# EAGLE design Reciever (EAGLE 8.4.0)
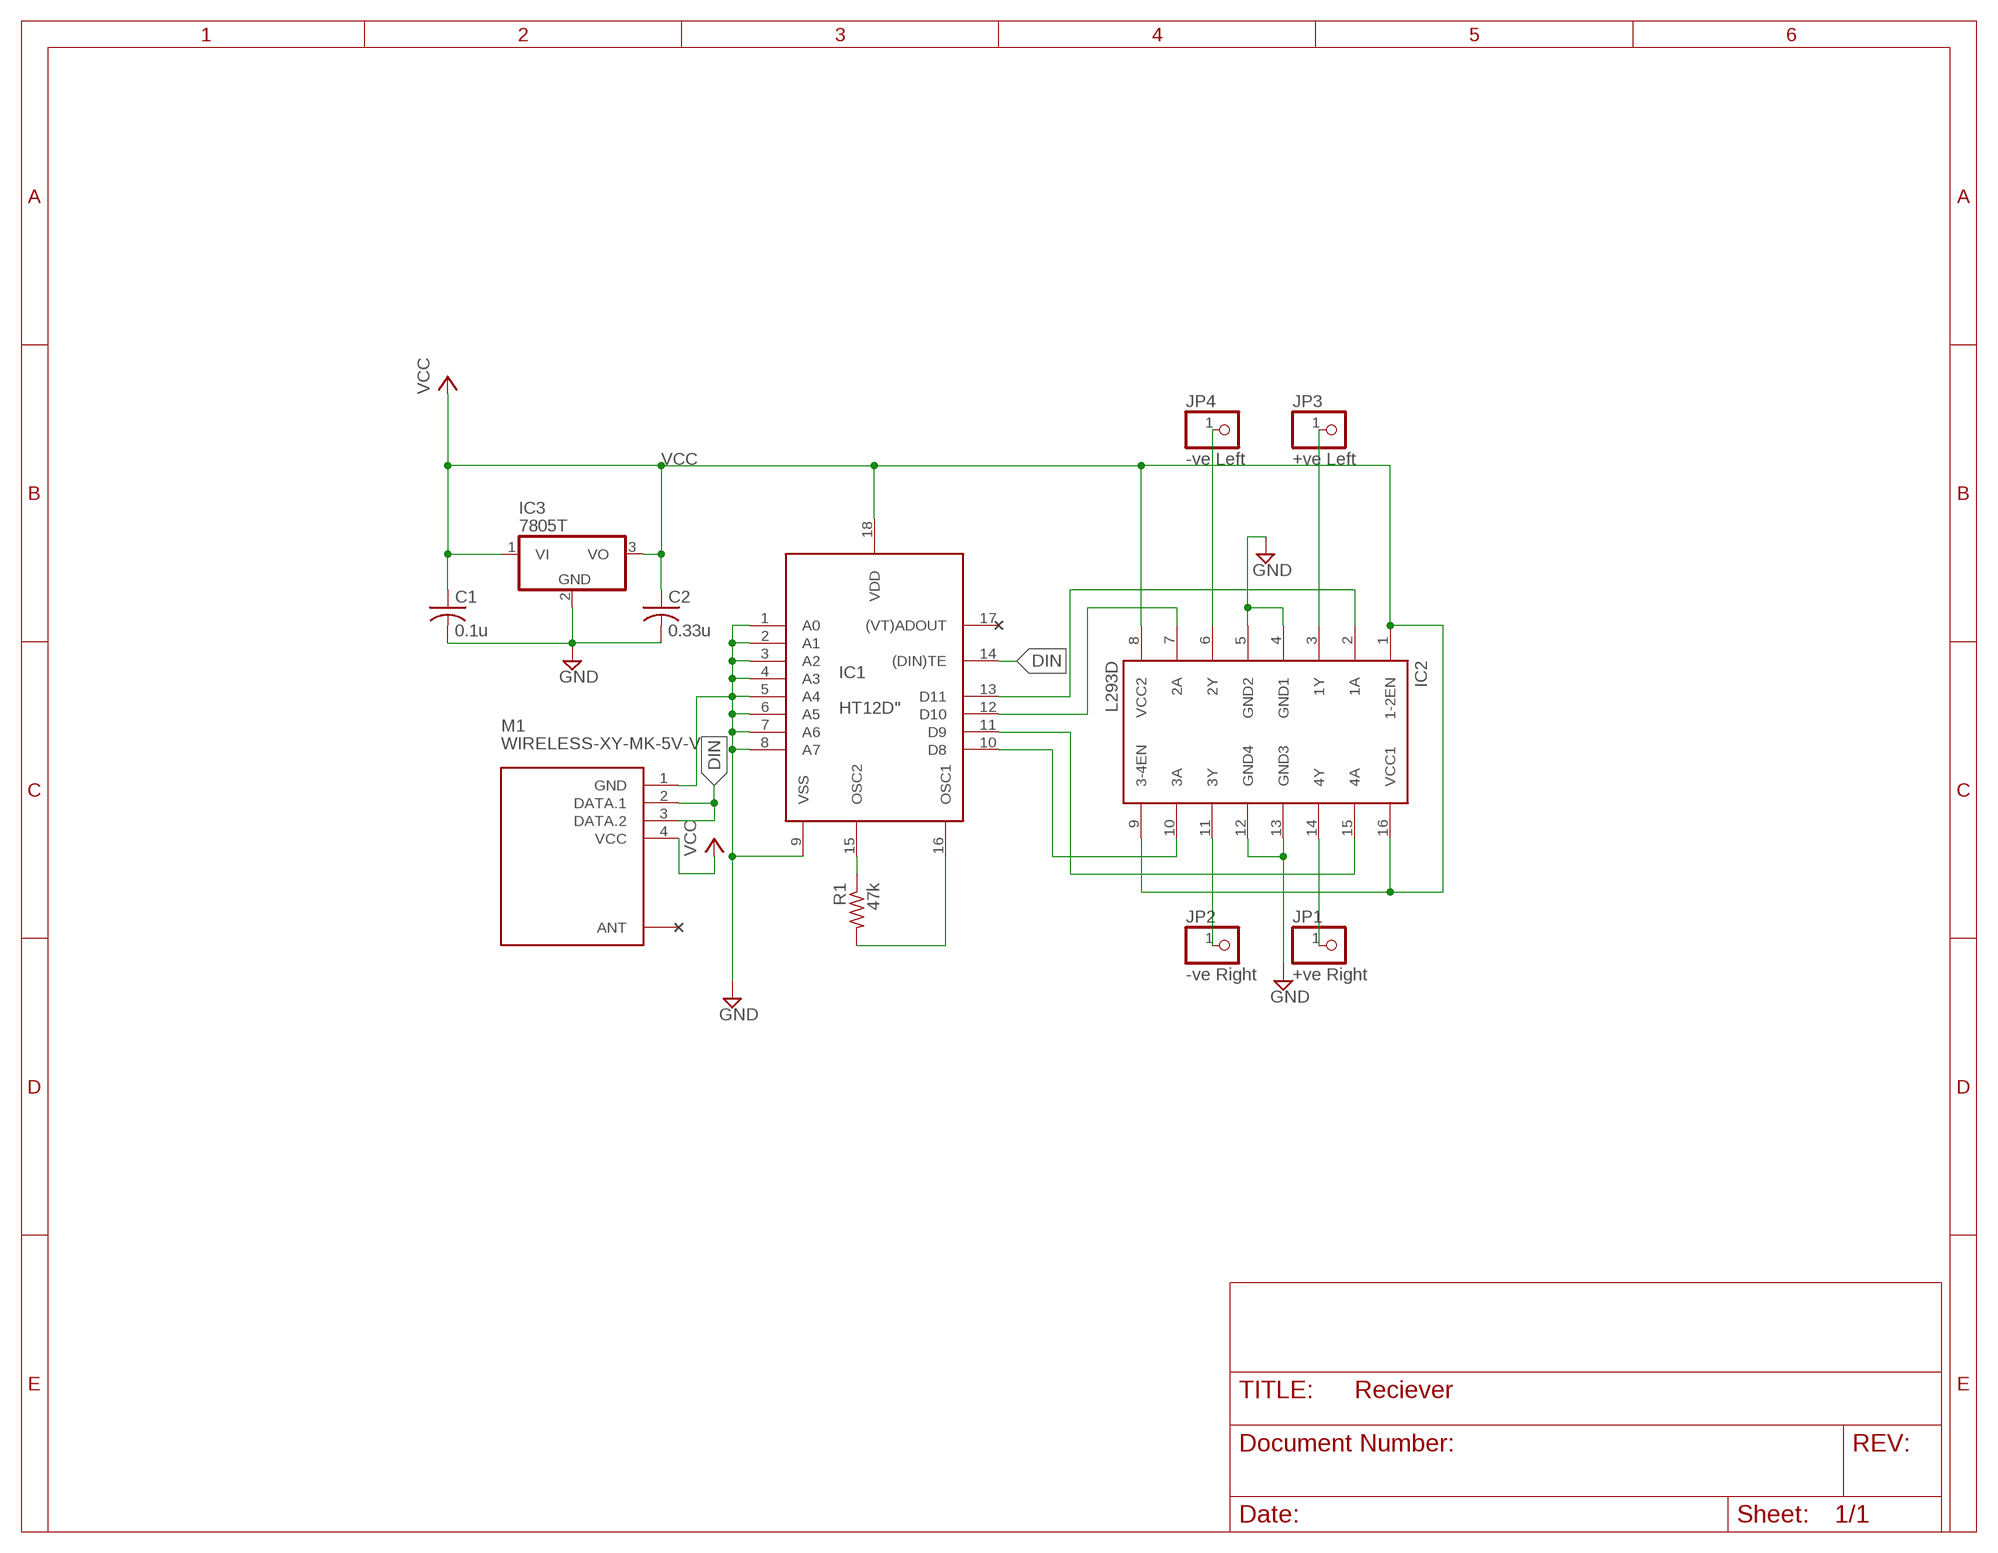
[diagram p0: schematic, sheet 1]

## Parts
C1  0.1u  C-USC0805  [C0805]
C2  0.33u  C-USC0805  [C0805]
IC1  HT12D"  [18-DIP-A]
IC2  L293D  [DIL16]
IC3  7805T  [TO220H]
JP1  +ve Right  PINHD-1X1  [1X01]
JP2  -ve Right  PINHD-1X1  [1X01]
JP3  +ve Left  PINHD-1X1  [1X01]
JP4  -ve Left  PINHD-1X1  [1X01]
M1  WIRELESS-XY-MK-5V-V  [WIRELESS-XY-MK-5V#V]
R1  47k  R-US_R0805  [R0805]

## Nets
DIN: IC1.14((DIN)TE) M1.2(DATA.1) M1.3(DATA.2)
GND: C1.2 C2.2 IC1.1(A0) IC1.2(A1) IC1.3(A2) IC1.4(A3) IC1.5(A4) IC1.6(A5) IC1.7(A6) IC1.8(A7) IC1.9(VSS) IC2.4(GND1) IC2.5(GND2) IC2.12(GND4) IC2.13(GND3) IC3.2(GND) M1.1(GND)
N$2: IC2.6(2Y) JP4.1
N$3: IC1.10(D8) IC2.10(3A)
N$4: IC1.15(OSC2) R1.1
N$5: IC1.16(OSC1) R1.2
N$6: IC1.11(D9) IC2.15(4A)
N$7: IC1.12(D10) IC2.7(2A)
N$8: IC1.13(D11) IC2.2(1A)
N$9: IC2.3(1Y) JP3.1
N$11: IC2.11(3Y) JP2.1
N$12: IC2.14(4Y) JP1.1
VCC: C1.1 C2.1 IC1.18(VDD) IC2.1(1-2EN) IC2.8(VCC2) IC2.9(3-4EN) IC2.16(VCC1) IC3.1(VI) IC3.3(VO) M1.4(VCC)
Unconnected: IC1.17((VT)ADOUT) M1.ANT

## Library data of the parts
C1 C2 = adafruit:C-US: CAPACITOR, American symbol
IC1 = holtek:HT12D: decoder = receiver ic
IC2 = st-microelectronics:L293D: PUSH-PULL 4 CHANNEL DRIVER; MPN: L293D; OC_FARNELL: 9589619; OC_NEWARK: 56P8249
IC3 = adafruit:78*: Positive VOLTAGE REGULATOR Added bigger pads to the TO-92 package
JP1-JP4 = adafruit:PINHD-1X1: Pin header 1x1 for 0.1" spacing With round pins
M1 = diy-modules:WIRELESS-XY-MK-5V: RF Wireless XY-MK-5V Receiver Click here to find device on ebay.com <http://www.ebay.com/sch/xd+rf+5v-receiver> Note: Sold together with transmitter.
R1 = adafruit:R-US_: RESISTOR, American symbol

## Board
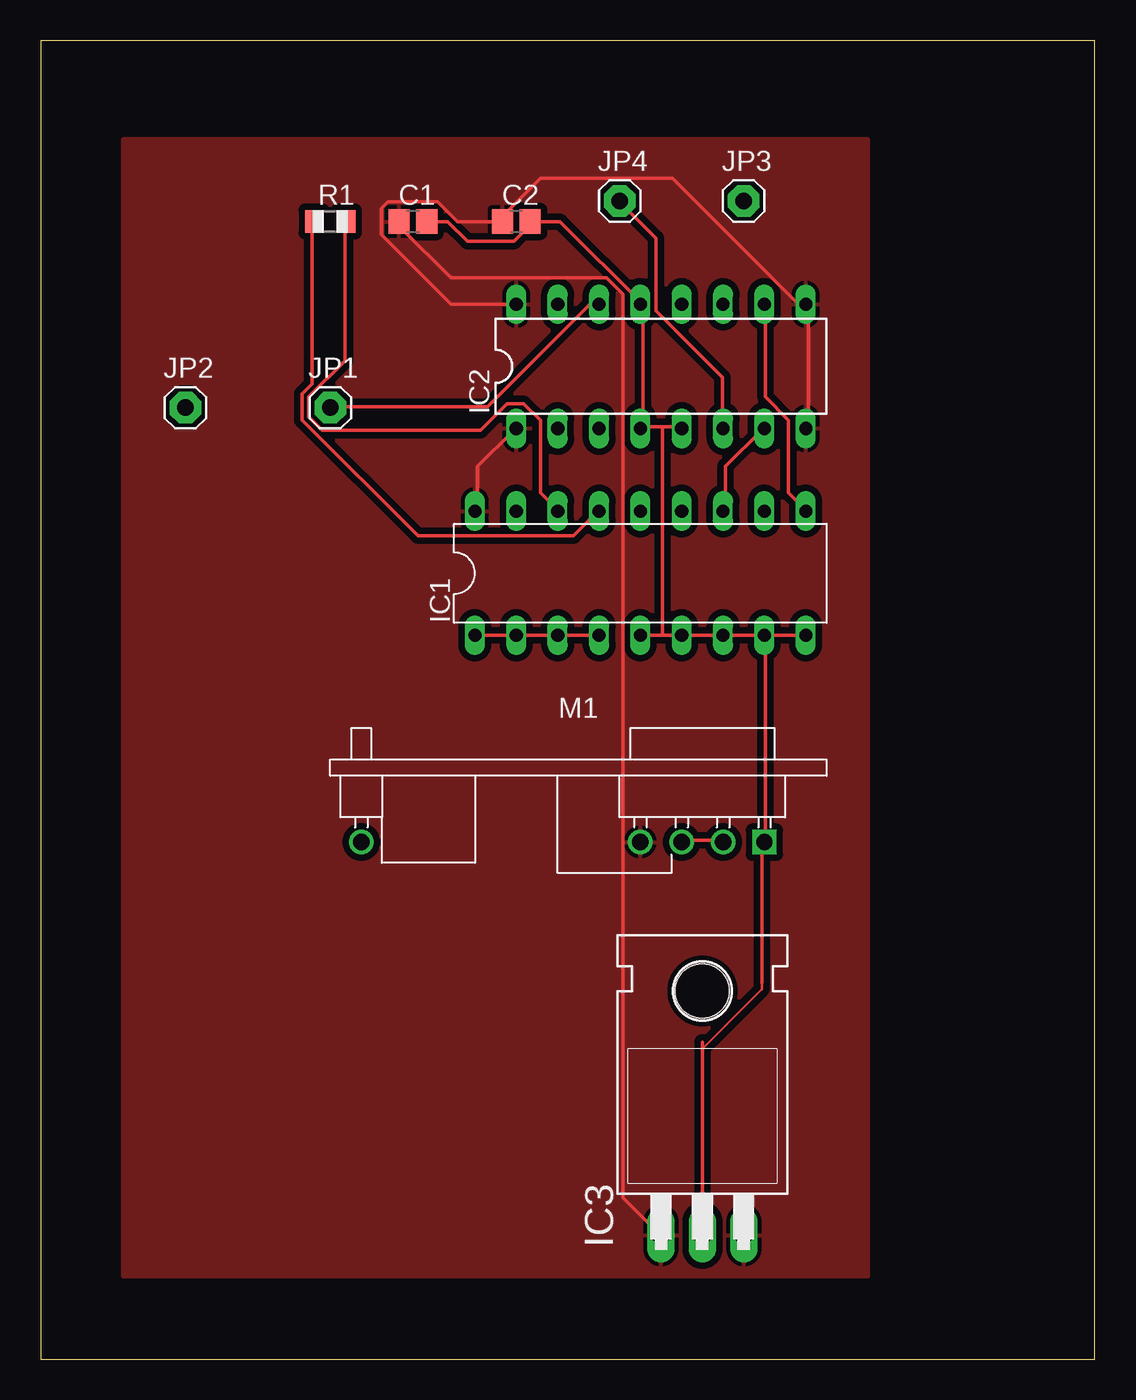
[diagram p1: board, top side]
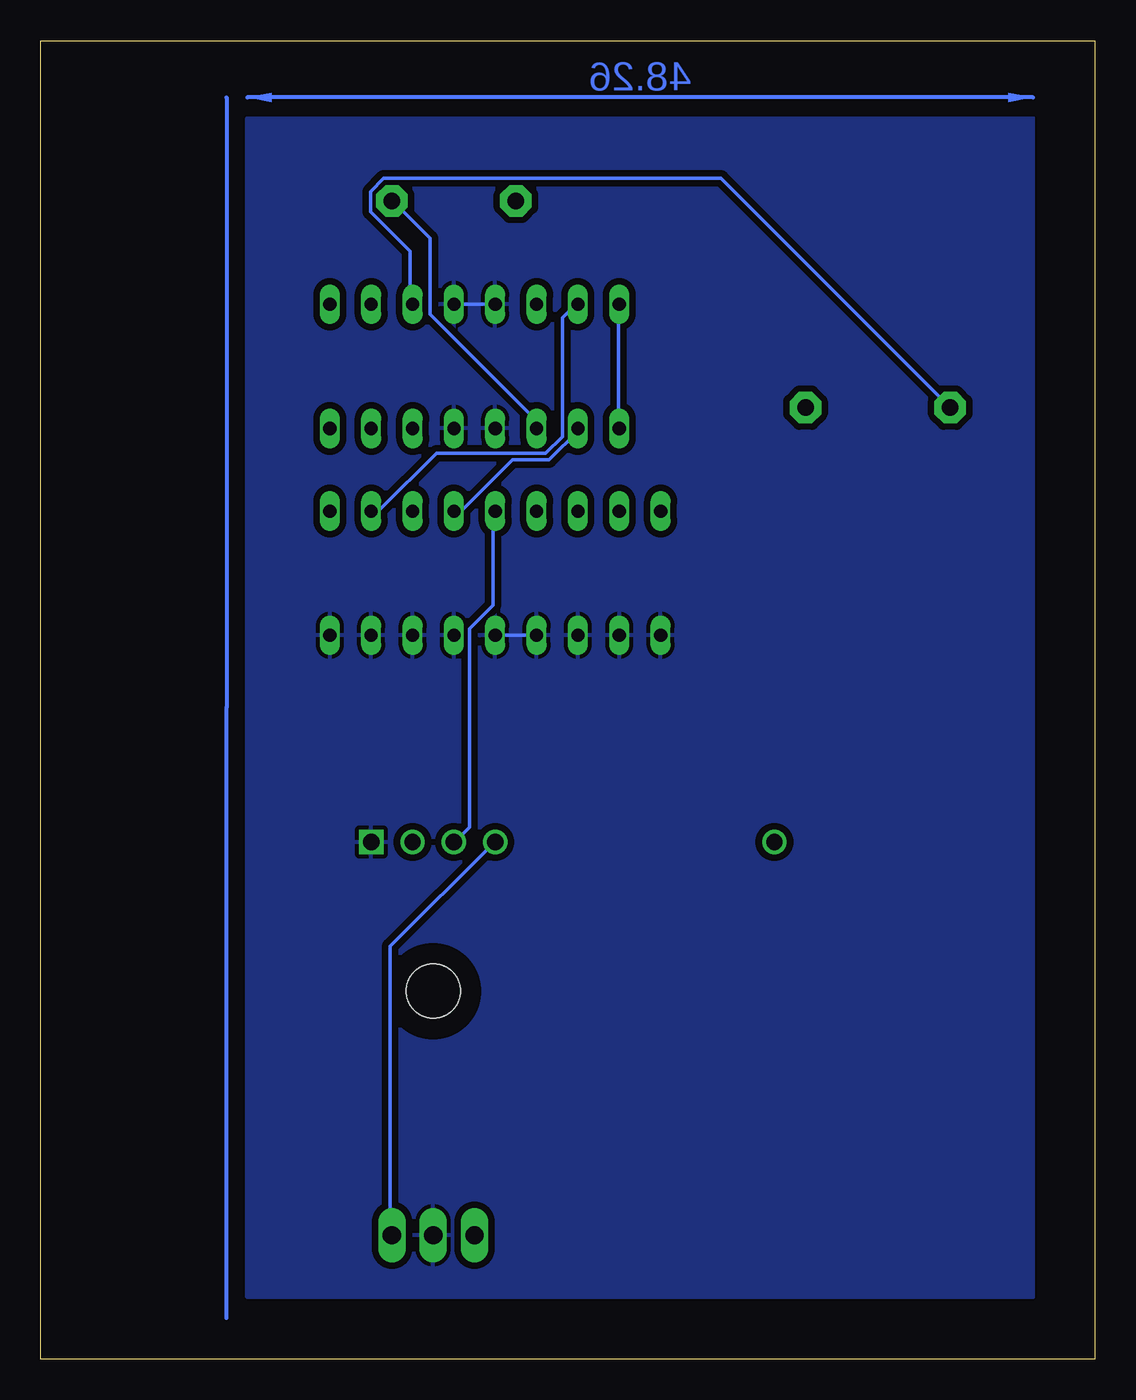
[diagram p2: board, bottom side, seen from below]

Size 64.75 x 80.95 mm. Coordinates in mm from the lower left corner, seen from the top.
Outline: 0,0 64.75,0 64.75,80.95 0,80.95 0,0
Copper layers (1*16): Top 0.0178mm / dielectric 59mil / Bottom 0.0178mm
Design rules "sunstone-valueproto *": minimum track width 6mil, minimum drill 6mil, track to track 7mil, track to pad 7mil, pad to pad 7mil, via to via 7mil, smd to smd 7mil, copper to edge 20mil, drill to drill 16mil, minimum pad ring 8mil, minimum via ring 8mil, stop-mask expansion 3mil, vias tented up to drill 0mil, thermal gap 10mil

### Footprints (pad centres in the part's own frame; a part is rotated, then mirrored left to right if it is on the bottom)
C0805 = smd 1.3 x 1.5: 1 -0.85,0; 2 0.85,0
18-DIP-A = drill 0.813 long: 1 -10.16,-3.81; 2 -7.62,-3.81; 3 -5.08,-3.81; 4 -2.54,-3.81; 5 0,-3.81; 6 2.54,-3.81; 7 5.08,-3.81; 8 7.62,-3.81; 9 10.16,-3.81; 10 10.16,3.81; 11 7.62,3.81; 12 5.08,3.81; 13 2.54,3.81; 14 0,3.81; 15 -2.54,3.81; 16 -5.08,3.81; 17 -7.62,3.81; 18 -10.16,3.81
DIL16 = drill 0.813 long: 1 -8.89,-3.81; 2 -6.35,-3.81; 3 -3.81,-3.81; 4 -1.27,-3.81; 5 1.27,-3.81; 6 3.81,-3.81; 7 6.35,-3.81; 8 8.89,-3.81; 9 8.89,3.81; 10 6.35,3.81; 11 3.81,3.81; 12 1.27,3.81; 13 -1.27,3.81; 14 -3.81,3.81; 15 -6.35,3.81; 16 -8.89,3.81
TO220H = drill 1.118 long: 1 -2.54,-10.16; 2 0,-10.16; 3 2.54,-10.16 | hole 3.302: 0,4.826
1X01 = drill 1.016 pad 1.93 octagon: 1 0,0
WIRELESS-XY-MK-5V#V = drill 1 square: 1 11.43,0 | drill 1: 2 8.89,0; 3 6.35,0; 4 3.81,0; ANT -13.335,0
R0805 = smd 1.1 x 1.4: 1 -1,0; 2 1,0

### Placement (x,y rotation side)
C1  22.86,69.85 0 top
C2  29.21,69.85 0 top
IC1  36.83,48.26 0 top
IC2  38.1,60.96 0 top
IC3  40.64,17.78 0 top
JP1  17.78,58.42 0 top
JP2  8.89,58.42 0 top
JP3  43.18,71.12 0 top
JP4  35.56,71.12 0 top
M1  33.02,31.75 0 top
R1  17.78,69.85 0 top

### Tracks (layer width: path | path; a pad name or v marks a point on that pad's centre or on a via)
DIN
  Top 0.203: M1.2 41.86,31.85 39.42,31.85 M1.3
  Bottom 0.203: IC1.14 36.98,51.97 36.98,46.28 38.41,44.86 38.41,32.66 39.22,31.85 M1.3
GND
  Top 0.152: 40.64,19.05 44.3,22.71 44.3,23.11
  Top 0.203: C1.2 24.99,69.85 26.21,68.63 29.06,68.63 29.87,69.44 29.87,69.85 C2.2 31.9,69.85 36.98,64.77 | 38.2,57.25 39.22,57.25 IC2.5 | 38.2,57.25 36.98,57.25 | 36.98,64.77 36.98,57.25 | 36.98,57.25 IC2.4 | 36.98,64.77 IC2.13 | 38.2,44.45 IC1.6 IC1.7 IC1.8 44.5,44.45 | 38.2,44.45 IC1.5 | IC1.1 IC1.2 IC1.3 IC1.4 | 44.5,44.45 IC1.9 | 44.5,44.45 44.5,31.85 M1.1 44.3,31.65 44.3,23.11 | 40.64,19.46 40.64,19.05 IC3.2 | 38.2,44.45 38.2,57.25
  Bottom 0.203: IC2.12 IC2.13 | IC1.4 IC1.5
  pour Bottom (isolate 0.406): 3.81,76.2 3.81,3.81 52.07,3.81 52.07,76.2
N$2
  Top 0.203: IC2.6 41.86,57.25 41.86,60.3 37.8,64.36 37.8,68.83 35.56,71.07 JP4.1
N$3
  Top 0.203: IC2.10 44.5,64.77 44.5,59.08 45.92,57.66 45.92,53.19 46.94,52.17 IC1.10
N$4
  Top 0.203: R1.1 16.66,69.85 16.66,59.89 16.05,59.28 16.05,57.66 23.17,50.55 32.72,50.55 34.14,51.97 IC1.15
N$5
  Top 0.203: R1.2 18.69,69.85 18.69,61.32 16.46,59.08 16.46,57.86 17.27,57.05 27.03,57.05 28.65,58.67 29.67,58.67 30.68,57.66 30.68,53.19 31.7,52.17 IC1.16
N$6
  Bottom 0.203: IC1.11 44.3,52.17 43.89,52.17 40.44,55.63 33.73,55.63 32.72,56.64 32.72,63.96 31.9,64.77 IC2.15
N$7
  Top 0.203: IC1.12 42.06,52.17 42.06,54.81 44.3,57.05 IC2.7
N$8
  Bottom 0.203: IC1.13 39.22,52.17 38.81,52.17 35.76,55.22 33.53,55.22 31.7,57.05 IC2.2
N$9
  Bottom 0.203: IC2.3 34.34,57.25 34.34,57.66 40.84,64.16 40.84,68.83 43.08,71.07 JP3.1
N$11
  Bottom 0.203: JP2.1 22.96,72.49 43.69,72.49 44.5,71.68 44.5,70.46 42.06,68.02 42.06,64.77 IC2.11
N$12
  Top 0.203: IC2.14 33.73,64.77 27.43,58.47 17.88,58.47 JP1.1
VCC
  Top 0.203: C1.1 22.15,69.85 22.15,69.44 25.2,66.4 34.75,66.4 35.76,65.38 35.76,9.91 38,7.67 IC3.1 | IC2.8 47.14,57.25 47.14,64.77 IC2.9 46.53,64.77 38.81,72.49 30.68,72.49 28.04,69.85 | 28.04,69.85 25.6,69.85 24.38,71.07 21.34,71.07 20.93,70.66 20.93,69.04 25.2,64.77 IC2.16 | 28.04,69.85 C2.1 28.25,69.85 | 26.82,52.17 26.82,54.81 29.06,57.05 IC2.1
  Bottom 0.203: 36.98,31.65 43.28,25.35 43.28,7.67 IC3.3 | IC2.16 29.26,64.77 29.26,57.25 IC2.1
  pour Top (isolate 0.406): 5.08,74.93 50.8,74.93 50.8,60.96 50.8,5.08 6.35,5.08 5.08,5.08
(copper drawn outside any net)
  shapes: Bottom area x2